# EAGLE design ketamine (EAGLE 6.5.0)
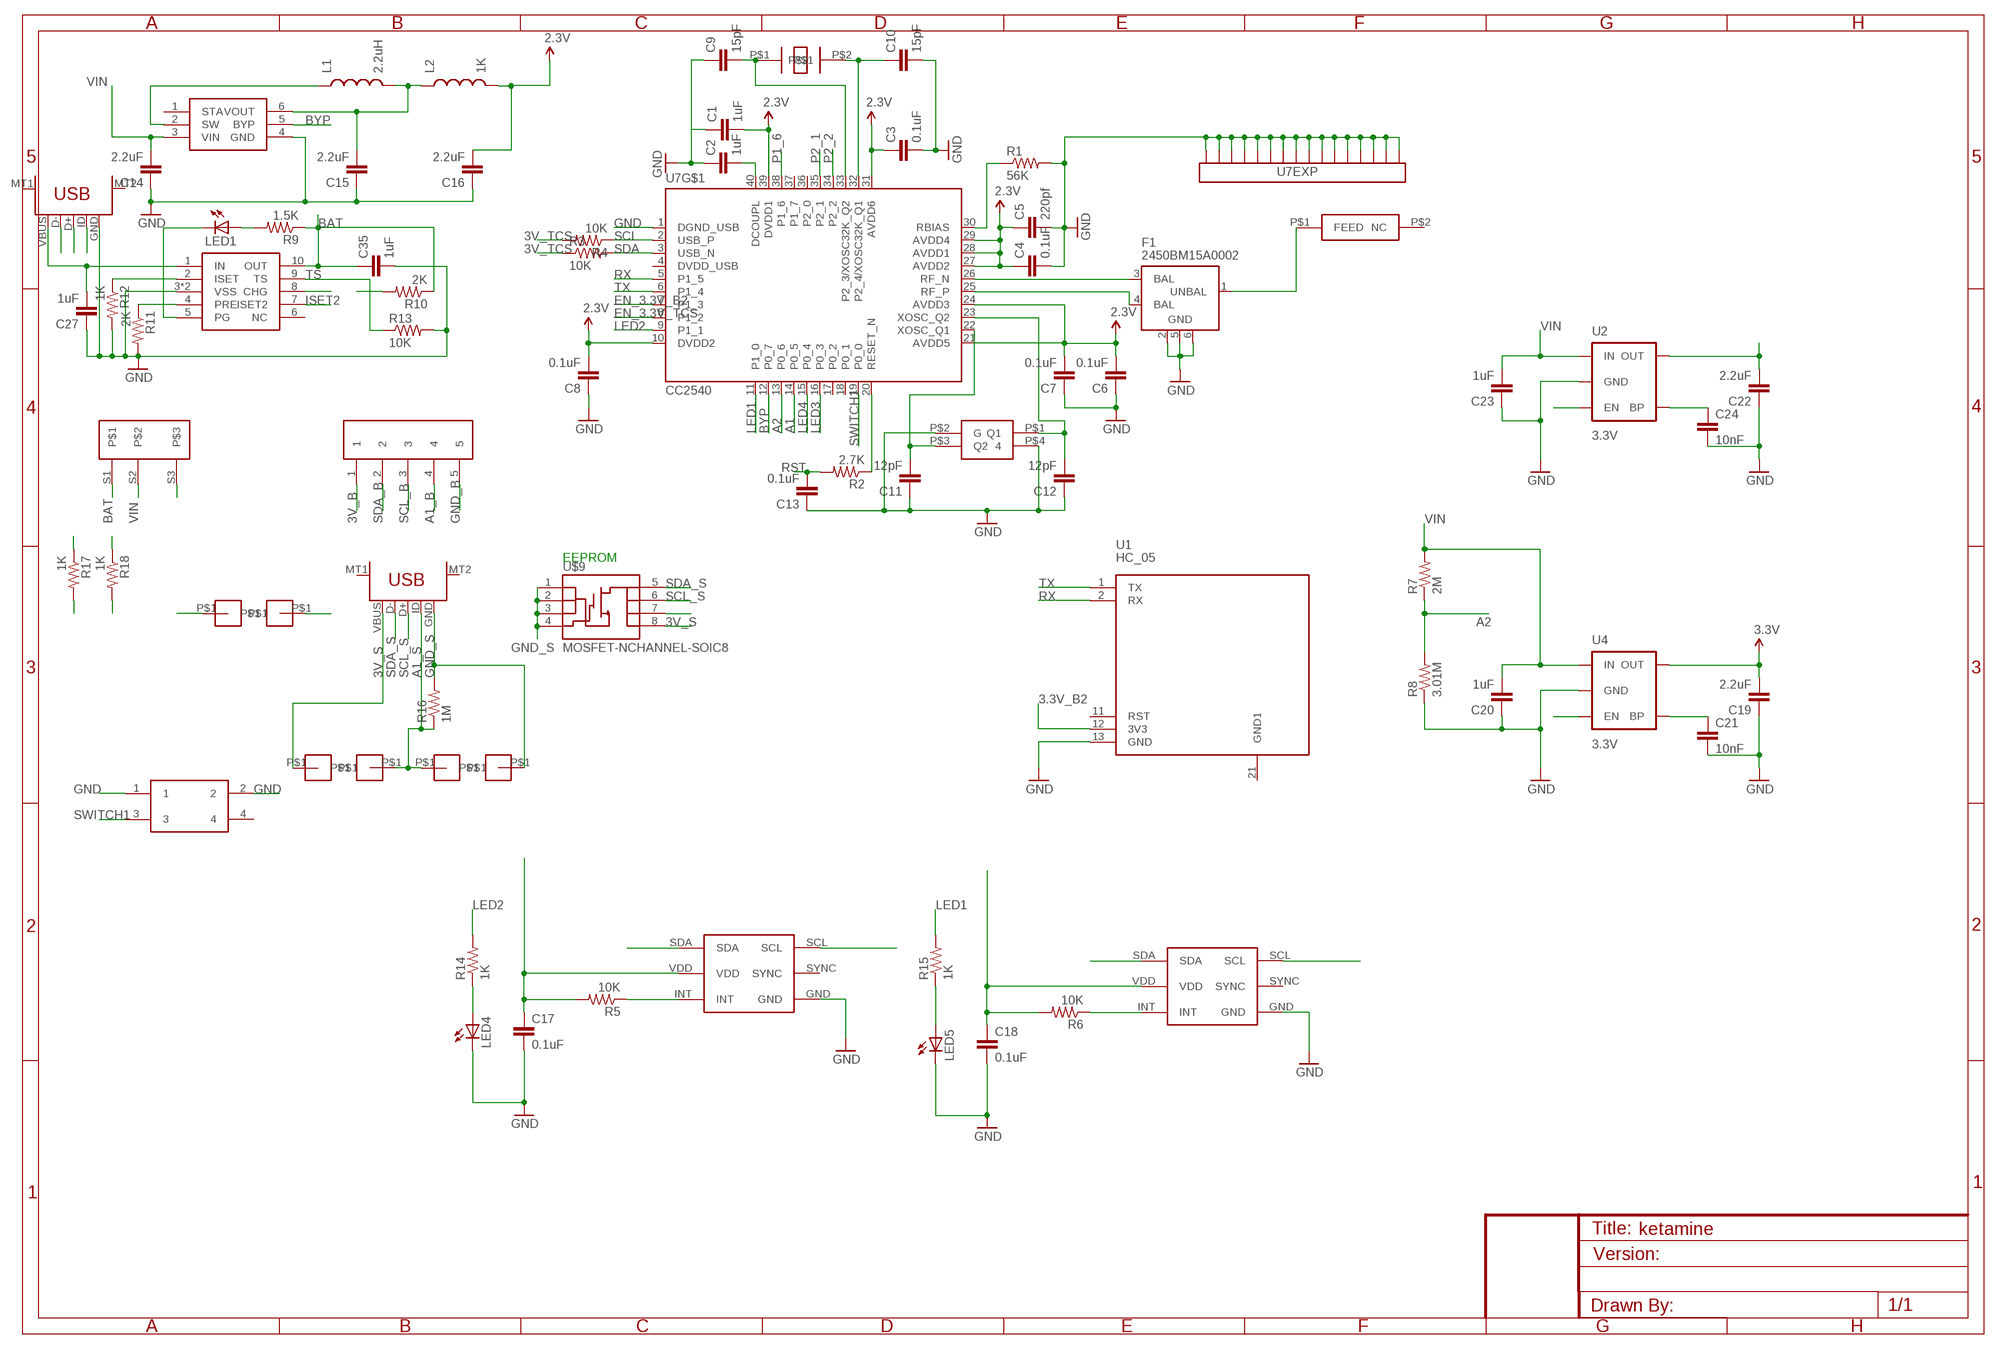
[diagram p0: schematic, sheet 1]

## Parts
C1  1uF  CAP0402-CAP  [0402-CAP]
C2  1uF  CAP0402-CAP  [0402-CAP]
C3  0.1uF  CAP0402-CAP  [0402-CAP]
C4  0.1uF  CAP0402-CAP  [0402-CAP]
C5  220pf  CAP0402-CAP  [0402-CAP]
C6  0.1uF  CAP0402-CAP  [0402-CAP]
C7  0.1uF  CAP0402-CAP  [0402-CAP]
C8  0.1uF  CAP0402-CAP  [0402-CAP]
C9  15pF  CAP0402-CAP  [0402-CAP]
C10  15pF  CAP0402-CAP  [0402-CAP]
C11  12pF  CAP0402-CAP  [0402-CAP]
C12  12pF  CAP0402-CAP  [0402-CAP]
C13  0.1uF  CAP0402-CAP  [0402-CAP]
C14  2.2uF  CAP0402-CAP  [0402-CAP]
C15  2.2uF  CAP0402-CAP  [0402-CAP]
C16  2.2uF  CAP0402-CAP  [0402-CAP]
C17  0.1uF  CAP0402-CAP  [0402-CAP]
C18  0.1uF  CAP0402-CAP  [0402-CAP]
C19  2.2uF  CAP0402-CAP  [0402-CAP]
C20  1uF  CAP0402-CAP  [0402-CAP]
C21  10nF  CAP0402-CAP  [0402-CAP]
C22  2.2uF  CAP0402-CAP  [0402-CAP]
C23  1uF  CAP0402-CAP  [0402-CAP]
C24  10nF  CAP0402-CAP  [0402-CAP]
C27  1uF  CAP0402-CAP  [0402-CAP]
C35  1uF  CAP0402-CAP  [0402-CAP]
F1  2450BM15A0002  [2450BM15A0002]
L1  2.2uH  INDUCTOR0805  [0805]
L2  1K  INDUCTOR0402  [C0402]
LED1  LED0603  [LED-0603]
LED4  LED0603  [LED-0603]
LED5  LED0603  [LED-0603]
R1  56K  RESISTOR0402-RES  [0402-RES]
R2  2.7K  RESISTOR0402-RES  [0402-RES]
R3  10K  RESISTOR0402-RES  [0402-RES]
R4  10K  RESISTOR0402-RES  [0402-RES]
R5  10K  RESISTOR0402-RES  [0402-RES]
R6  10K  RESISTOR0402-RES  [0402-RES]
R7  2M  RESISTOR0402-RES  [0402-RES]
R8  3.01M  RESISTOR0402-RES  [0402-RES]
R9  1.5K  RESISTOR0402-RES  [0402-RES]
R10  2K  RESISTOR0402-RES  [0402-RES]
R11  2K  RESISTOR0402-RES  [0402-RES]
R12  1K  RESISTOR0402-RES  [0402-RES]
R13  10K  RESISTOR0402-RES  [0402-RES]
R14  1K  RESISTOR0402-RES  [0402-RES]
R15  1K  RESISTOR0402-RES  [0402-RES]
R16  1M  RESISTOR0402-RES  [0402-RES]
R17  1K  RESISTOR0402-RES  [0402-RES]
R18  1K  RESISTOR0402-RES  [0402-RES]
S1  SK12C0405  [SK12C0405]
S2  SWITCH_SMD_6X6  [6X6MM]
U1  HC_05  [BLUETOOTH_SMD]
U2  3.3V  V_REG_LDOSMD  [SOT23-5]
U4  3.3V  V_REG_LDOSMD  [SOT23-5]
U5  TCS3414CS  [CHIPSCALE6]
U6  TCS3414CS  [CHIPSCALE6]
U7  CC2540  [QFN40-6X6]
U$1  2450AT42A100  [2450AT42A100]
U$2  FA128  [FA128]
U$3  ST3215SB  [ST3215SB]
U$4  TPS62730  [TPS62730]
U$8  MICRO_USB_PLUG  [MICRO_USB_PLUG]
U$9  MOSFET-NCHANNEL-SOIC8  [SO08]
U$10  5X3PAD  [5X3PAD]
U$11  5X3PAD  [5X3PAD]
U$12  5X3PAD  [5X3PAD]
U$13  5X3PAD  [5X3PAD]
U$14  5X3PAD  [5X3PAD]
U$15  5X3PAD  [5X3PAD]
U$23  BQ24040  [WSON-10]
X1  USB_MICROB_RECEPT  [USB-MICROB]
X2  USB_MICROB_RECEPT  [USB-MICROB]

## Nets
2.3V: C1.2 C3.1 C4.1 C5.1 C6.2 C7.2 C8.2 C16.2 L2.2 U7.10(DVDD2) U7.21(AVDD5) U7.24(AVDD3) U7.27(AVDD2) U7.28(AVDD1) U7.29(AVDD4) U7.31(AVDD6) U7.39(DVDD1)
3.3V_B2: C19.2 U1.12(3V3) U4.5(OUT) ; supply symbol labelled 3.3V
3V_B: U$8.1
3V_S: U$9.8(D) U$14.P$1 X2.VBUS
3V_TCS: C17.1 C18.1 C22.2 R3.1 R4.2 R5.2 R6.2 U2.5(OUT) U5.VDD U6.VDD
A1: U7.14(P0_5)
A1_B: U$8.4
A1_S: R16.1 U$10.P$1 U$15.P$1 X2.ID
A2: R7.1 R8.2 U7.13(P0_6)
BAT: C35.1 R9.1 R10.1 S1.S1 U$23.10(OUT)
BYP: U7.12(P0_7) U$4.5(BYP)
EN_3.3V_B2: U4.3(EN) U7.7(P1_3)
EN_3.3V_TCS: U2.3(EN) U7.8(P1_2)
GND: C1.1 C2.1 C3.2 C4.2 C5.2 C6.1 C7.1 C8.1 C9.1 C10.2 C11.1 C12.1 C13.1 C14.1 C15.1 C16.1 C17.2 C18.2 C19.1 C20.1 C21.2 C22.1 C23.1 C24.2 C27.1 C35.2 F1.2(GND) F1.5(GND) F1.6(GND) LED4.C LED5.C R1.2 R8.1 R11.2 R12.2 R13.2 S2.1 S2.2 U1.13(GND) U2.2(GND) U4.2(GND) U5.GND U6.GND U7.1(DGND_USB) U7.EXP@1(EXP:EXP16) U7.EXP@2(EXP:EXP16) U7.EXP@3(EXP:EXP16) U7.EXP@4(EXP:EXP16) U7.EXP@5(EXP:EXP16) U7.EXP@6(EXP:EXP16) U7.EXP@7(EXP:EXP16) U7.EXP@8(EXP:EXP16) U7.EXP@9(EXP:EXP16) U7.EXP@10(EXP:EXP16) U7.EXP@11(EXP:EXP16) U7.EXP@12(EXP:EXP16) U7.EXP@13(EXP:EXP16) U7.EXP@14(EXP:EXP16) U7.EXP@15(EXP:EXP16) U7.EXP@16(EXP:EXP16) U$2.P$2(G) U$2.P$4 U$4.4(GND) U$23.3(VSS) U$23.PAD(VSS) X1.GND
GND_B: U$8.5
GND_S: R16.2 U$9.1(S) U$9.2(S) U$9.3(S) U$9.4(G) U$9.7(D) U$11.P$1 X2.GND
INT: R5.1 U5.INT
INT1: R6.1 U6.INT
ISET2: U$23.7(ISET2)
LED1: R15.2 U7.11(P1_0)
LED2: R14.2 U7.9(P1_1)
LED3: R17.2 U7.16(P0_3)
LED4: R18.2 U7.15(P0_4)
N$1: R1.1 U7.30(RBIAS)
N$2: C21.1 U4.4(BP)
N$3: F1.3(BAL) U7.26(RF_N)
N$4: F1.4(BAL) U7.25(RF_P)
N$5: C2.2 U7.40(DCOUPL)
N$6: C9.2 U7.33(P2_3/XOSC32K_Q2) U$3.P$1
N$7: C24.1 U2.4(BP)
N$8: C11.2 U7.22(XOSC_Q1) U$2.P$3(Q2)
N$9: C12.2 U7.23(XOSC_Q2) U$2.P$1(Q1)
N$10: C10.1 U7.32(P2_4/XOSC32K_Q1) U$3.P$2
N$11: L1.1 U$4.2(SW)
N$12: C15.2 L1.2 L2.1 U$4.6(VOUT)
N$13: S1.S3
N$15: U$13.P$1
N$16: U$12.P$1
N$18: R18.1
N$19: F1.1(UNBAL) U$1.P$1(FEED)
N$20: R17.1
N$24: R2.1 U7.20(RESET_N)
N$26: LED1.C U$23.5(PG)
N$27: LED1.A R9.2
N$28: LED4.A R14.1
N$29: LED5.A R15.1
N$41: R11.1 U$23.4(PRE)
N$49: R12.1 U$23.2(ISET)
N$51: U$23.8(CHG)
N$52: R10.2
P1_6: U7.38(P1_6)
P2_1: U7.35(P2_1) X1.D+
P2_2: U7.34(P2_2) X1.ID
RST: C13.2 R2.2 X1.D-
RX: U1.2(RX) U7.5(P1_5)
SCL: R4.1 U5.SCL U6.SCL U7.2(USB_P)
SCL_B: U$8.3
SCL_S: U$9.6(D) X2.D+
SDA: R3.2 U5.SDA U6.SDA U7.3(USB_N)
SDA_B: U$8.2
SDA_S: U$9.5(D) X2.D-
SWITCH1: S2.3 U7.19(P0_0)
TS: R13.1 U$23.9(TS)
TX: U1.1(TX) U7.6(P1_4)
VBUS: C27.2 U$23.1(IN) X1.VBUS
VIN: C14.2 C20.2 C23.2 R7.2 S1.S2 U2.1(IN) U4.1(IN) U$4.3(VIN)
Unconnected: S2.4 U1.11(RST) U1.21(GND1) U5.SYNC U6.SYNC U7.17(P0_2) U7.18(P0_1) U7.36(P2_0) U7.37(P1_7) U$1.P$2(NC) U$4.1(STA) U$23.6(NC) X1.MT1(MTN2) X1.MT2(MTN4) X2.MT1(MTN2) X2.MT2(MTN4)

## Notes on the sheet
- EEPROM

## Power pins joined to a net without a drawn wire
DVDD_USB: U7.4(DVDD_USB)

## Library data of the parts
C1-C18 C27 C35 = SparkFun:CAP: Capacitor Standard 0603 ceramic capacitor, and 0.1" leaded capacitor.
C19-C24 = SparkFun-Capacitors:CAP: Capacitor Standard 0603 ceramic capacitor, and 0.1" leaded capacitor.
F1 = johanson-technology:2450BM15A0002: 2.45 GHz Impedance Matched Balun-Filter For TI CC253X/CC2540 Chipset family Data sheet <http://www.johansontechnology.com/images/stories/ip/baluns/balun_filter_combo_matched_2450bm15a0002_v8.pdf>
L1 L2 = SparkFun:INDUCTOR: Inductors Basic Inductor/Choke - 0603 and 1206. Footprints are not proven and vary greatly between part numbers.
LED1 LED4 LED5 = SparkFun:LED: LEDs Standard schematic elements and footprints for 5mm, 3mm, 1206, and 0603 sized LEDs. 5mm - Spark Fun Electronics SKU : COM-00529 (and others)
R1-R6 R9-R18 = SparkFun:RESISTOR: Resistor Basic schematic elements and footprints for 0603, 1206, and PTH resistors.
R7 R8 = SparkFun-Resistors:RESISTOR: Resistor Basic schematic elements and footprints for 0603, 1206, and PTH resistors.
S1 = Switch_SK12C0405:SK12C0405
S2 = SWITCH_SMD:SWITCH_SMD_6X6
U1 = Bluetooth HC-05:HC_05: HC-05 Bluetooth Module
U2 U4 = SparkFun:V_REG_LDO: Voltage Regulator LDO Standard 150mA LDO voltage regulator in SOT-23 layout. Micrel part MIC5205. BP (by-pass) pin is used to lower output noise with 470pF cap.
U5 U6 = TCS3414CS:TCS3414CS
U7 = texas:CC2540: 2.4-GHz Bluetooth® low energy System-on-Chip Auto generated by make-symbol-device-package-bsdl.ulp Rev. 39 Source: cc2540.txt
U$1 = 2450AT42A100:2450AT42A100
U$2 = FA128:FA128
U$3 = ST3215sb:ST3215SB
U$4 = TPS62730:TPS62730
U$8 = Micro_USB_plug_pcb:MICRO_USB_PLUG
U$9 = SparkFun:MOSFET-NCHANNEL-SOIC8: N-Channel MOSFET IRF9410 and NDS8434 are common, SOIC-8 parts.
U$10-U$15 = 5x3Pad:5X3PAD
U$23 = PP_DigitalIC:BQ24040
X1 X2 = SparkFun:USB_MICROB_RECEPT

## Board
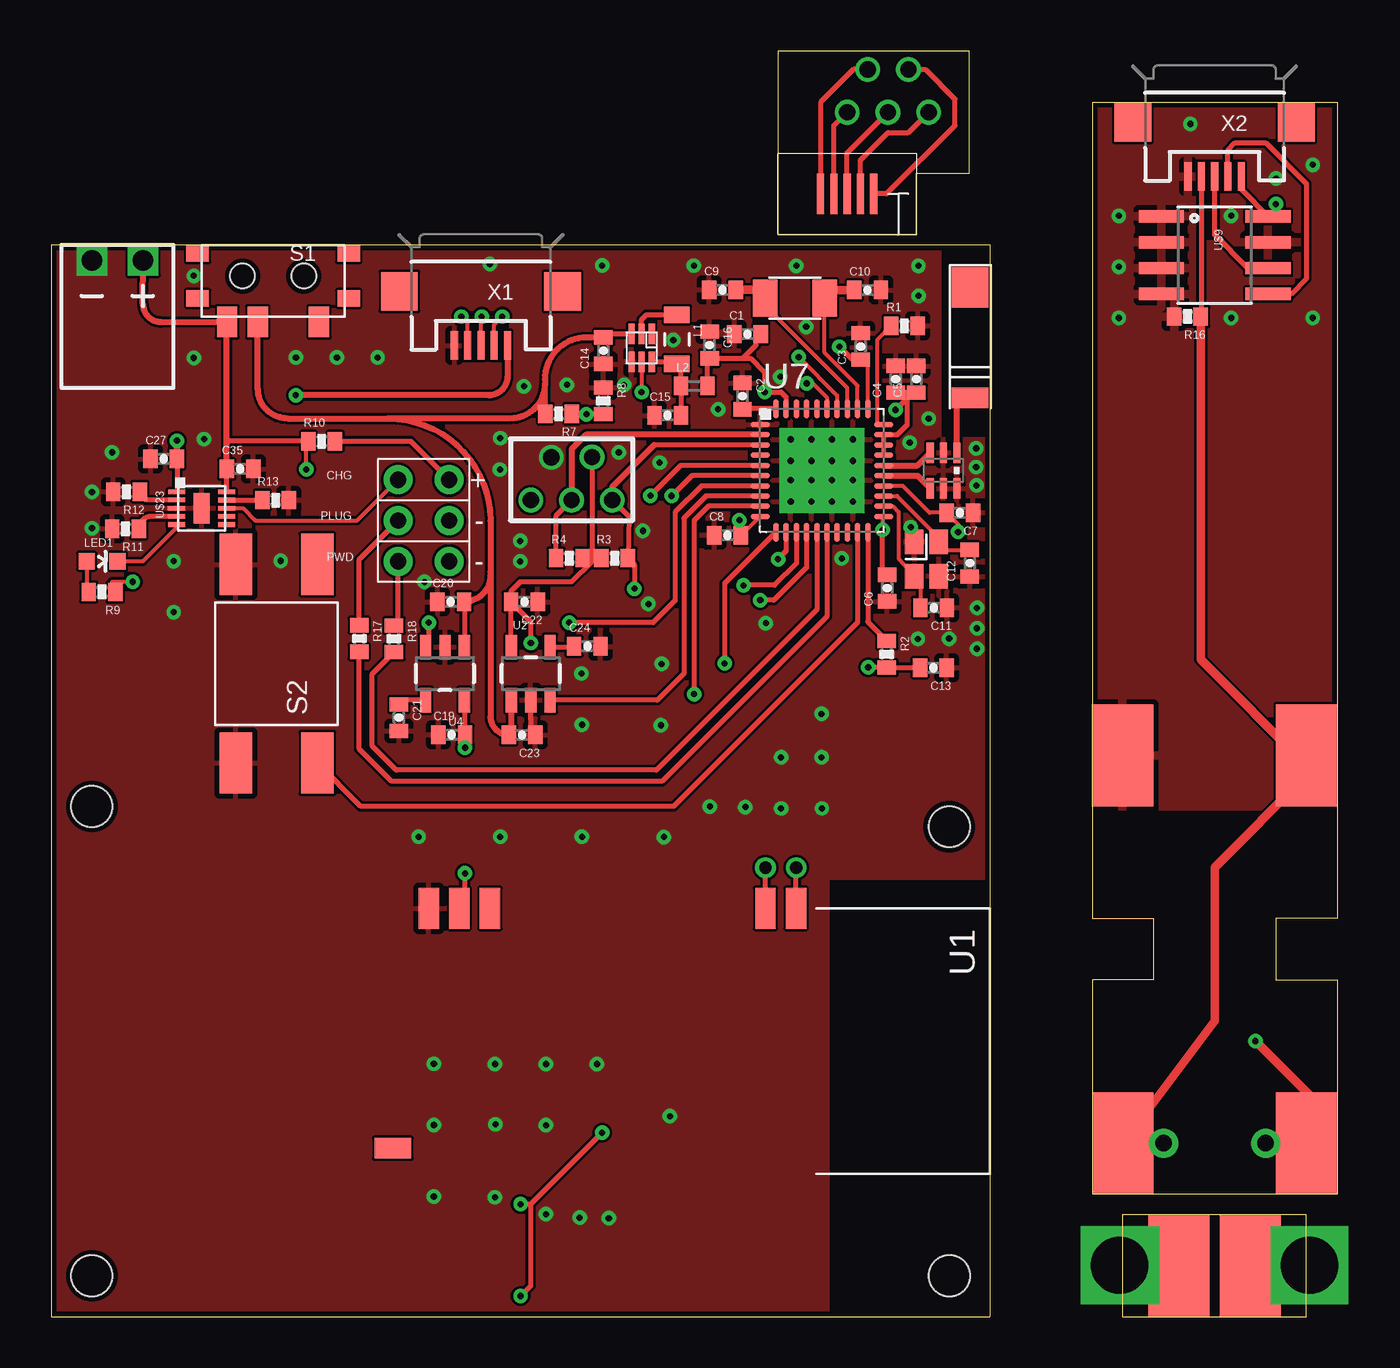
[diagram p1: board, top side]
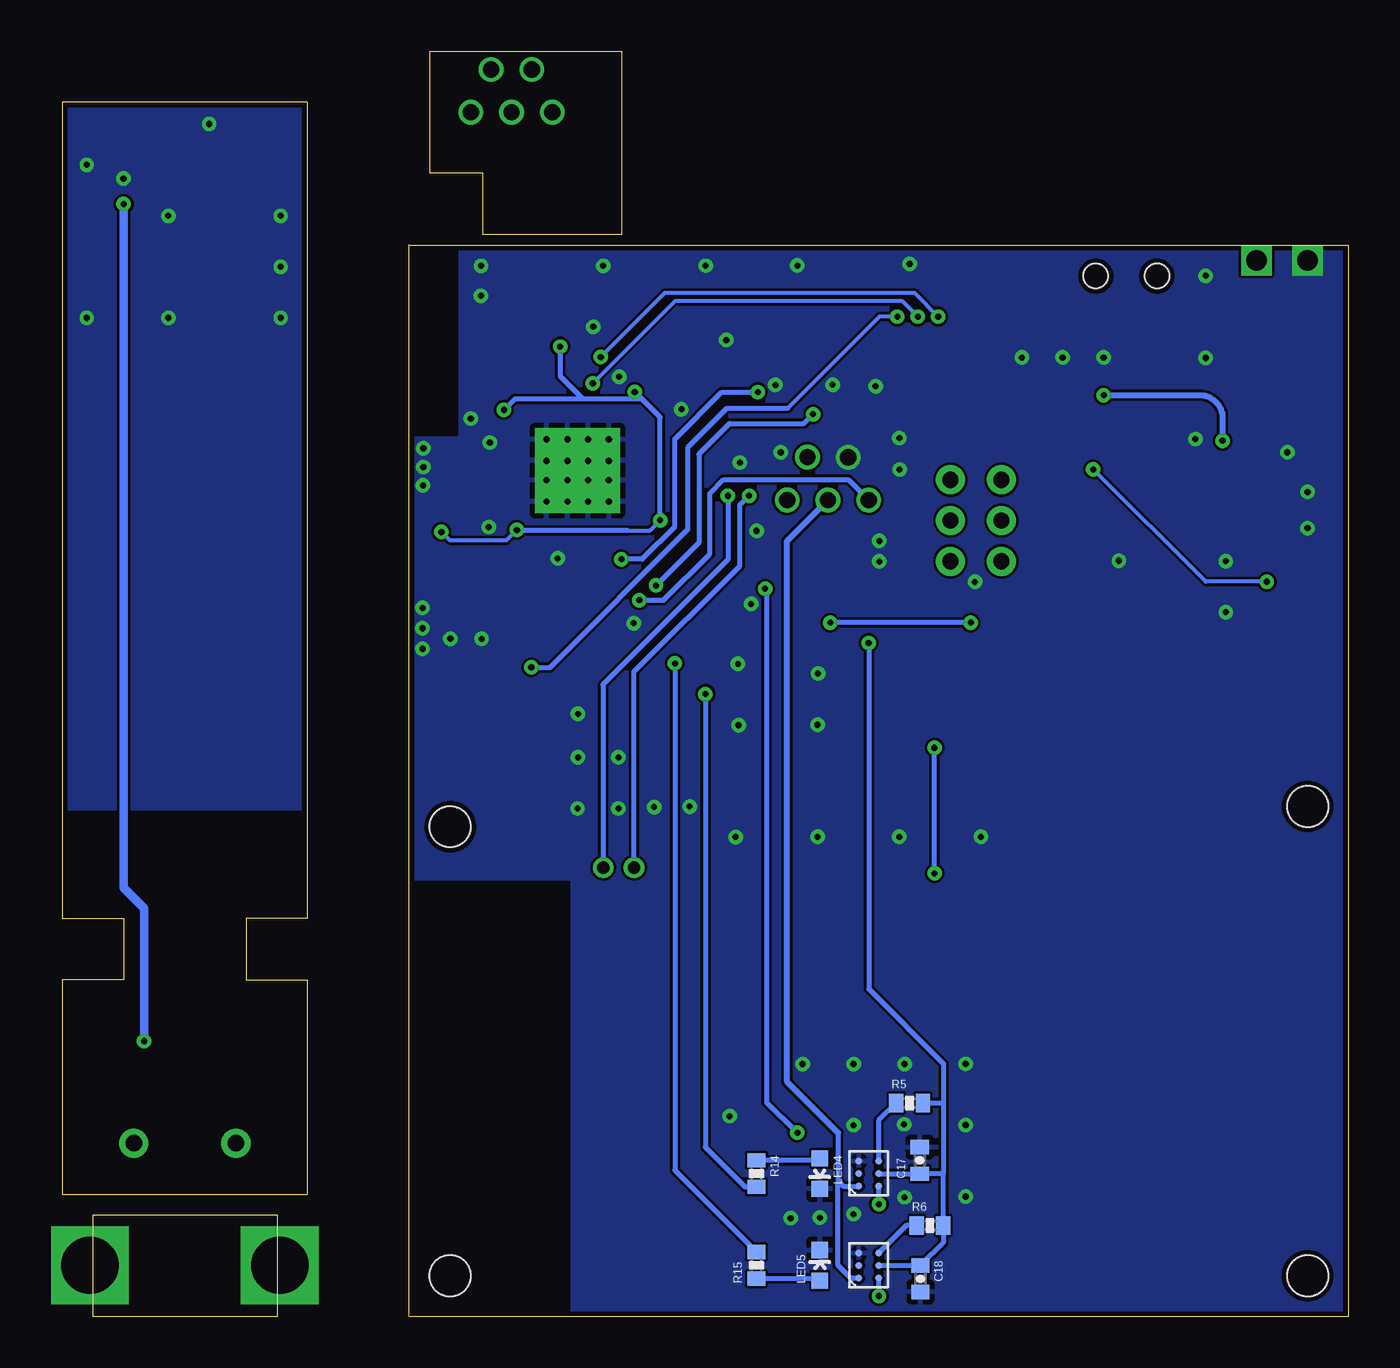
[diagram p2: board, bottom side, seen from below]

Size 63 x 62 mm. Coordinates in mm from the lower left corner, seen from the top.
Outline: 46.02,0.02 46.02,52.52
Outline: 46,52.5 0,52.5 0,0 46,0
Outline: 51,59.5 63,59.5 63,19.5 60,19.5 60,16.5 63,16.5 63,6 51,6 51,16.5 54,16.5 54,19.5 51,19.5 51,59.5
Outline: 35.6,53 42.4,53 42.4,56.01 45,56.01 45,62 35.6,62 35.6,53
Outline: 61.5,5 52.47,5 52.47,0 61.5,0 61.5,5
Copper layers (1*16): Top 0.035mm / dielectric 1.5mm / Bottom 0.035mm
Design rules "default *": minimum track width 4mil, minimum drill 4mil, track to track 5mil, track to pad 5mil, pad to pad 5mil, via to via 5mil, smd to smd 5mil, copper to edge 10mil, drill to drill 8mil, minimum pad ring 10mil, minimum via ring 8mil, stop-mask expansion 4mil, vias tented up to drill 0mil, thermal gap 10mil
Holes 2 mm at 2,25 44,24 2,2 44,2

### Footprints (pad centres in the part's own frame; a part is rotated, then mirrored left to right if it is on the bottom)
0402-CAP = smd 0.7 x 0.9: 1 -0.65,0; 2 0.65,0
2450BM15A0002 = smd 0.35 x 1: 1 -0.65,-0.875; 2 0,-0.875; 3 0.65,-0.875; 4 0.65,0.875; 5 0,0.875; 6 -0.65,0.875
0805 = smd 0.8 x 1.25: 1 -1.2,0; 2 1.2,0
C0402 = smd 0.7 x 0.9: 1 -0.65,0; 2 0.65,0
LED-0603 = smd 0.8 x 0.8: A 0,-0.75; C 0,0.75
0402-RES = smd 0.7 x 0.9: 1 -0.65,0; 2 0.65,0
SK12C0405 = smd 1.1 x 0.8: P$1 -3.7,-1.1; P$2 -3.7,1.1; P$3 3.7,-1.1; P$4 3.7,1.1 | smd 1 x 1.5: S1 2.25,2.25; S2 0.75,2.25; S3 -2.25,2.25 | hole 1.2: -1.5,0; 1.5,0
6X6MM = smd 3 x 1.6: 1 -4.865,2; 2 4.865,2; 3 -4.865,-2; 4 4.865,-2
BLUETOOTH_SMD = smd 2 x 1: 1 0,0; 2 0,-1.5; 11 0,-15; 12 0,-16.5; 13 0,-18 | smd 1 x 1.8: 21 11.75,-19.75
SOT23-5 = smd 0.55 x 1.2: 1 -0.95,-1.3; 2 0,-1.3; 3 0.95,-1.3; 4 0.95,1.3; 5 -0.95,1.3
CHIPSCALE6 = smd 0.35 x 0.35: GND 0.61,0.485; INT 0.61,-0.485; SCL -0.61,0.485; SDA -0.61,-0.485; SYNC 0,0.485; VDD 0,-0.485
QFN40-6X6 = smd 0.95 x 0.28: 1 -3.025,2.25; 2 -3.025,1.75; 3 -3.025,1.25; 4 -3.025,0.75; 5 -3.025,0.25; 6 -3.025,-0.25; 7 -3.025,-0.75; 8 -3.025,-1.25; 9 -3.025,-1.75; 10 -3.025,-2.25; 21 3.025,-2.25; 22 3.025,-1.75; 23 3.025,-1.25; 24 3.025,-0.75; 25 3.025,-0.25; 26 3.025,0.25; 27 3.025,0.75; 28 3.025,1.25; 29 3.025,1.75; 30 3.025,2.25 | smd 0.28 x 0.95: 11 -2.25,-3.025; 12 -1.75,-3.025; 13 -1.25,-3.025; 14 -0.75,-3.025; 15 -0.25,-3.025; 16 0.25,-3.025; 17 0.75,-3.025; 18 1.25,-3.025; 19 1.75,-3.025; 20 2.25,-3.025; 31 2.25,3.025; 32 1.75,3.025; 33 1.25,3.025; 34 0.75,3.025; 35 0.25,3.025; 36 -0.25,3.025; 37 -0.75,3.025; 38 -1.25,3.025; 39 -1.75,3.025; 40 -2.25,3.025 | drill 0.3 pad 1.1 square: EXP@1 -1.525,1.525; EXP@2 -0.5,1.525; EXP@3 0.5,1.525; EXP@4 1.525,1.525; EXP@5 -1.525,0.475; EXP@6 -0.5,0.475; EXP@7 0.5,0.475; EXP@8 1.525,0.475; EXP@9 -1.525,-0.475; EXP@10 -0.5,-0.475; EXP@11 0.5,-0.475; EXP@12 1.525,-0.475; EXP@13 -1.525,-1.525; EXP@14 -0.5,-1.525; EXP@15 0.5,-1.525; EXP@16 1.525,-1.525
2450AT42A100 = smd 1 x 1.8: P$1 -2.5,0 | smd 2 x 1.8: P$2 2.9,0
FA128 = smd 1.2 x 0.9: P$1 -0.85,0.6; P$2 0.85,0.6; P$3 0.85,-0.6; P$4 -0.85,-0.6
ST3215SB = smd 1.2 x 1.8: P$1 -1.2,0; P$2 1.7,0
TPS62730 = smd 0.3 x 1: 1 -0.5,-0.68; 2 0,-0.68; 3 0.5,-0.68; 4 0.5,0.68; 5 0,0.68; 6 -0.5,0.68
MICRO_USB_PLUG = smd 0.35 x 2: 1 -1.3,1.5; 2 -0.65,1.5; 3 0,1.5; 4 0.65,1.5; 5 1.3,1.5
SO08 = smd 0.61 x 2.21: 1 -1.905,-2.616; 2 -0.635,-2.616; 3 0.635,-2.616; 4 1.905,-2.616; 5 1.905,2.616; 6 0.635,2.616; 7 -0.635,2.616; 8 -1.905,2.616
5X3PAD = smd 3 x 5: P$1 0,0
WSON-10 = smd 0.23 x 0.85: 1 -0.8,-1.225; 2 -0.41,-1.225; 3 0,-1.23; 4 0.4,-1.225; 5 0.8,-1.225; 6 0.8,1.225; 7 0.4,1.225; 8 0,1.225; 9 -0.4,1.225; 10 -0.8,1.225 | smd 1.5 x 0.8: PAD 0,0
USB-MICROB = smd 0.35 x 1.4: D+ 0,2.65; D- -0.65,2.65; GND 1.3,2.65; ID 0.65,2.65; VBUS -1.3,2.65 | smd 1.8 x 1.9: MT1 -4,0; MT2 4,0

### Placement (x,y rotation side)
C1  34.12,48.13 0 top
C2  33.87,45.09 270 top
C3  39.66,47.53 90 top
C4  41.38,45.92 90 top
C5  42.39,45.92 90 top
C6  40.96,35.69 90 top
C7  44.52,39.38 180 top
C8  33.14,38.28 0 top
C9  32.89,50.3 0 top
C10  40,50.29 0 top
C11  43.24,34.73 180 top
C12  45.01,36.91 90 top
C13  43.22,31.79 180 top
C14  27.06,47.32 90 top
C15  30.21,44.15 0 top
C16  32.26,47.6 270 top
C17  21,7.65 90 bottom
C18  20.97,1.86 270 bottom
C19  19.63,28.51 0 top
C20  19.58,35.02 0 top
C21  17.04,29.34 270 top
C22  23.19,35.02 180 top
C23  23.07,28.5 180 top
C24  26.27,32.84 0 top
C27  5.52,42.02 0 top
C35  9.26,41.53 0 top
F1  43.72,41.45 180 top
L1  30.66,47.88 270 top
L2  31.51,45.59 0 top
LED1  2.5,37 270 top
LED4  25.9,7.01 180 bottom
LED5  25.9,2.51 0 bottom
R1  41.81,48.54 0 top
R2  40.94,32.45 270 top
R3  27.61,37.16 0 top
R4  25.39,37.16 0 top
R5  21.5,10.47 0 bottom
R6  20.5,4.47 0 bottom
R7  24.86,44.23 180 top
R8  27.06,44.86 270 top
R9  2.5,35.5 180 top
R10  13.26,42.88 0 top
R11  3.65,38.6 180 top
R12  3.7,40.41 180 top
R13  11,40 0 top
R14  29,7.01 270 bottom
R15  29,2.52 90 bottom
R16  55.67,48.99 180 top
R17  15.1,33.22 270 top
R18  16.8,33.21 270 top
S1  10.88,50.98 180 top
S2  11.05,31.99 90 top
U1  36.5,20 270 top
U2  23.5,31.5 0 top
U4  19.3,31.5 180 top
U5  23.5,7 90 bottom
U6  23.5,2.5 90 bottom
U7  37.76,41.45 0 top
U$1  45.03,47.52 90 top
U$2  42.89,37.12 270 top
U$3  36.19,49.9 0 top
U$4  28.93,47.46 180 top
U$8  39,56.5 180 top
U$9  57,52 270 top
U$10  61.5,27.5 0 top
U$11  52.49,27.5 0 top
U$12  58.75,2.5 0 top
U$13  55.25,2.5 0 top
U$14  61.5,8.5 0 top
U$15  52.5,8.5 0 top
U$23  7.38,39.6 270 top
X1  21.06,50.23 180 top
X2  57,58.5 180 top

### Tracks (layer width: path | path; a pad name or v marks a point on that pad's centre or on a via)
2.3V  (via drill 0.3)
  Top 0.2: C4.1 41.89,45.27 41.92,45.27 C5.1 | U7.24 41.72,40.7 43.04,39.38 C7.2 44.44,38.81 v44.44,38.44 | U7.31 40.01,46.88 C3.1 | U7.21 40.74,39.16 v40.74,38.54 | U7.10 arc90 U7.10 33.83,38.29 | C8.2 33.83,38.29 | 33.83,38.29 33.83,38.91 v33.72,39.02
  Top 0.254: U7.27 U7.28 U7.29 41.46,43.2 41.95,43.69 41.95,45.21 41.89,45.27 | L2.2 32.16,46.85 C16.2 33.89,46.95 | C3.1 39.26,46.88 v38.62,47.52 | v40.74,38.54 40.74,36.2 C6.2 | 33.89,46.95 34.54,47.6 34.54,47.9 C1.2 | U7.39 36.01,45.05 35.76,45.3 v34.96,45.3 34.96,46.25 34.26,46.95 33.89,46.95 | 41.92,45.27 41.92,44.97 v41.37,44.42
  Bottom 0.102: v40.74,38.54 40.86,38.45 39.59,38.45 39.59,38.52
  Bottom 0.2: v40.74,38.54 41.26,38.02 44.02,38.02 v44.44,38.44 | 35.32,38.52 34.22,38.52 v33.72,39.02
  Bottom 0.254: 35.32,38.52 39.59,38.52 40.72,38.52 | v33.72,39.02 33.72,44.06 34.62,44.95 | 34.62,44.95 v34.96,45.3 | 34.62,44.95 37.5,44.95 | 37.5,44.95 40.84,44.95 v41.37,44.42 | v38.62,47.52 38.62,46.08 37.5,44.95
3.3V_B2  (via drill 0.3)
  Top 0.254: U4.5 20.28,30.17 C19.2 v20.28,27.87 | U1.12 20.28,20.28 v20.28,21.72
  Bottom 0.254: v20.28,21.72 v20.28,27.87
3V_B  (via drill 0.8)
  Top 0.254: 40.33,55.87 40.3,55.84 U$8.1 40.93,55 44.28,58.35 44.28,59.65 42.85,61.08 42.02,61.08 v42,61.1
3V_S  (via drill 0.3, 0.8 pad 1.42)
  Top 0.254: X2.VBUS 58.3,55.22 U$9.8
  Top 0.406: v59,13.5 62.5,10 U$14.P$1 v59.5,8.5 | v60,54.5 60,54 59.71,54 U$9.8
  Bottom 0.406: v60,54.5 60,21 59,20 v59,13.5
3V_TCS  (via drill 0.3, 0.8)
  Top 0.254: R3.1 R4.2 26.34,37.16 26.5,37 | v26.5,42.11 26.5,37 | 22.5,35.06 C22.2 | C22.2 22.54,35.54 23,36 25.5,36 26.5,37 | C22.2 23.5,34.06 v23.5,33 | U2.5 C22.2
  Bottom 0.254: U5.VDD C17.1 19.85,7.01 | U6.VDD 23,2.51 C18.1 19.85,3.63 R6.2 19.85,7.01 | 19.86,7 19.85,7.01 | 19.85,10.51 19.85,7.01 | R5.2 19.89,10.47 arc-90 19.85,10.51 | 19.85,10.51 19.84,10.52 19.84,12.39 23.5,16.05 v23.5,33
A1  (via drill 0.3, 0.8)
  Top 0.254: v34.74,35.1 35.41,35.1 37.01,36.7 U7.14
  Bottom 0.254: v23.5,40 24.5,41 30.61,41 31.28,40.33 31.28,37.37 33.55,35.1 v34.74,35.1
A1_B  (via drill 0.8)
  Top 0.254: U$8.4 38.35,58.35 v39,59
A1_S  (via drill 0.8 pad 1.42)
  Top 0.254: X2.ID 56.35,49.02 R16.1
  Top 0.406: 61.5,27 61.5,26.5 57,22 57,14.5 U$15.P$1 v54.5,8.5 | 61.5,27 U$10.P$1 | R16.1 56.32,32.18 61.5,27
A2  (via drill 0.3)
  Top 0.254: R8.2 v26.23,44.21 25.53,44.21 R7.1 | U7.13 36.51,36.89 35.45,35.83 v33.93,35.83 v33.92,35.82
  Top 0.3: 25.51,44.33 R7.1
  Bottom 0.254: v33.92,35.82 31.82,37.92 31.82,42.25 30.31,43.76 26.68,43.76 v26.23,44.21
BAT  (via drill 0.3, 1)
  Top 0.102: 8.7,48.7 S1.S1
  Top 0.2: v12.5,41.5 12.5,42.5 R10.1 | v4,36 3,36 3,35.5 R9.1
  Top 0.254: U$23.10 C35.1 | R10.1 8.73,42.88 8.61,43
  Top 0.3: C35.1 8.61,43 8.61,48.71 S1.S1 8.12,48.74 5.38,48.73 arc-90 4.5,49.61 v4.51,51.75
  Bottom 0.2: v4,36 7,36 v12.5,41.5
BYP  (via drill 0.3)
  Top 0.2: U$4.5 v28.93,45.29
  Top 0.254: U7.12 36.01,37.5 v35.62,37.11
  Bottom 0.254: v28.93,45.29 30.71,45.29 33,43 33,38.71 34.6,37.11 v35.62,37.11
EN_3.3V_B2  (via drill 0.3)
  Top 0.254: U7.7 31.86,40.7 30.57,39.41 30.57,35.07 29.5,34 v25.38,34 | v18.5,34 18.5,33 U4.3
  Bottom 0.254: v18.5,34 v25.38,34
EN_3.3V_TCS
  Top 0.254: U7.8 32.08,40.2 31,39.12 31,31.5 29.7,30.2 U2.3 | U2.3
GND  (via drill 0.3, 0.8, 1)
  Top 0.102: 43.95,34.66 44.02,34.62 C11.1 | U$2.P$4 42.2,38 42.2,38.6 v42.12,38.68
  Top 0.254: U2.2 23.5,28.72 C23.1
  other vias: 6.01,37.01 32.68,44.45 45.34,40.72 42.5,50.01 45.32,41.62 30.48,47.84 42.06,42.82 45.36,33.72 36.51,51.48 45.36,34.72 45.32,42.54 2.01,51.75 24.5,42.1 25.27,45.65 23.17,45.58 16,46.99 14,46.99 30.32,9.82 27.32,4.82 21.75,5.84 11.25,37.03 7.5,42.99 6.01,34.51 22,43.04 22.98,38 37.75,27.4 29,38.49 22,41.49 42.99,43.99 43.99,33.22 42.47,33.2 18.3,35.99 29.91,31.98 29.27,34.91 29.88,28.98 26,29 25.98,31.5 31.5,51.48 21.5,51.58 2,38.62 2,40.4 3,42.34 11.99,46.99 37.74,29.53 25.89,4.84 24.25,5.02 18.75,5.88 24.25,9.38 26.75,12.37 24.25,12.37 21.75,12.37 28.07,45.64 37.77,24.89 35.77,27.39 35.77,24.89 38.74,37.14 36.99,48.49 27,51.49 22.98,37 34.02,24.96 32.27,24.98 30.02,23.5 26,23.5 22,23.5 18,23.5 7,50.99 7,46.97 35.02,33.98 45.36,32.72 42.49,51.48 21.77,9.42 18.75,9.38 18.75,12.38 35.73,46.05 29.81,41.84 27.81,42.34
  pour Bottom: -3.5,52.5 43.5,52.5 43.5,43 46,43 46,21.5 38,21.5 38,0 -3.5,0
  pour Top: -1,52.5 43.5,52.5 43.5,43 46,43 46,21.5 38,21.5 38,0 -1,0
GND_B  (via drill 0.8)
  Top 0.254: U$8.5 37.7,59.49 39.31,61.1 v40,61.1
GND_S  (via drill 0.3)
  Top 0.254: U$9.7 59.87,52.63 60,52.5
  other vias: 57.81,53.93 57.81,48.93 61.81,48.93 61.81,56.43 55.81,58.43 52.31,48.93 52.31,51.43 52.31,53.93 60.01,55.76
  pour Top: 51,25 63,25 63,63.5 51,63.5
  pour Bottom: 51,62.5 63,62.5 63,25 51,25
INT
  Bottom 0.254: R5.1 23.02,9.61 U5.INT
INT1
  Bottom 0.254: R6.1 21.66,4.47 U6.INT
LED1  (via drill 0.3)
  Top 0.254: v33,32 33,35.91 U7.11
  Bottom 0.254: v33,32 33,7.17 R15.2
LED2  (via drill 0.3)
  Top 0.254: U7.9 32.2,39.7 31.5,39 v31.5,30.5
  Bottom 0.254: v31.5,30.5 31.5,8.3 29.56,6.36 R14.2
LED3
  Top 0.254: U7.16 38.01,34.3 29.93,26.22 16.69,26.22 15.1,27.81 R17.2
LED4
  Top 0.254: U7.15 37.51,34.63 29.65,26.77 16.91,26.77 15.73,27.95 15.73,31.49 R18.2
N$1
  Top 0.2: U7.30 40.49,43.7 40.49,47.87 R1.1 40.86,48.28
N$2
  Top 0.254: U4.4 17.22,30.2 C21.1
N$3
  Top 0.3: U7.26 42.45,41.7 F1.3
N$4
  Top 0.3: U7.25 42.45,41.2 F1.4
N$5
  Top 0.254: U7.40 34.23,44.48 C2.2
N$6
  Top 0.2: U7.33 39.01,45.49 35,49.5 U$3.P$1 34.98,49.46
  Top 0.406: C9.2 34.59,50.3 U$3.P$1
N$7
  Top 0.254: U2.4 25.58,32.8 C24.1
N$8
  Top 0.2: U7.22 41.24,39.7 41.52,39.42 41.52,37.14 U$2.P$3 42.59,35.97 C11.2
N$9
  Top 0.2: U7.23 41.44,40.2 43.22,38.42 43.22,38.24 U$2.P$1 43.9,37.56 C12.2
N$10
  Top 0.2: 38.28,50.29 U$3.P$2 37.92,49.87 37.92,49.12 37.89,49.09 37.89,47.22 39.51,45.6 U7.32
  Top 0.406: C10.1 38.28,50.29
N$11
  Top 0.254: U$4.2 28.93,48.85 29.16,49.08 L1.1
N$12
  Top 0.254: U$4.6 30.56,46.78 L1.2 30.86,46.48 L2.1 C15.2
N$14  (via drill 0.8 pad 1.42)
  other vias: 19.5,39
N$15  (via drill 2.8)
  Top 1.27: U$13.P$1 v52.35,2.5 v52.35,2.51
N$16  (via drill 2.8)
  Top 1.27: U$12.P$1 61.65,2.5 v61.65,2.52
N$17  (via drill 0.8 pad 1.42)
  other vias: 19.5,37
N$18  (via drill 0.8 pad 1.42)
  Top 0.254: R18.1 17,34.06 v17,37
N$19
  Top 0.3: F1.1 44.37,45.02 U$1.P$1
N$20  (via drill 0.8 pad 1.42)
  Top 0.254: R17.1 15.1,37.1 v17,39
N$24
  Top 0.254: U7.20 40.01,34.03 R2.1
N$26
  Top 0.2: U$23.5 6.16,38.66 4.5,37 LED1.C
N$27
  Top 0.2: LED1.A 1.75,35.6 R9.2
N$28
  Bottom 0.254: LED4.A 26,7.66 R14.1
N$29
  Bottom 0.254: R15.1 26.01,1.87 LED5.A
N$41
  Top 0.254: U$23.4 4.9,39.2 arc90 R11.1
N$49
  Top 0.254: U$23.2 4.75,40.01 arc-90 R12.1
N$51  (via drill 0.8 pad 1.42)
  Top 0.2: U$23.8 9.4,39.6 10,39 15,39 v17,41
N$52  (via drill 0.8 pad 1.42)
  Top 0.254: R10.2 17.62,42.88 v19.5,41
P2_1  (via drill 0.3)
  Top 0.2: X1.D+ 21.06,48.95 v21.1,48.99 | v37.02,45.72 37.32,45.72 38.01,45.03 U7.35
  Bottom 0.2: v21.1,48.99 21.85,49.74 33,49.74 v37.02,45.72
P2_2  (via drill 0.3)
  Top 0.2: X1.ID 20.41,48.68 v20.1,48.99 | v36.63,47.01 38.51,45.13 U7.34
  Bottom 0.2: v20.1,48.99 21.25,50.14 33.5,50.14 v36.63,47.01
RST  (via drill 0.3)
  Top 0.2: X1.D- 21.71,48.6 v22.1,48.99
  Top 0.254: v40.03,31.81 v40.04,31.8 R2.2 42.22,31.8 C13.2
  Bottom 0.2: v22.11,48.98 v22.1,48.99 22.97,48.99 27.46,44.5
  Bottom 0.254: v40.03,31.81 39.11,31.81 32.37,38.55 32.37,42.57 30.44,44.5 27.46,44.5
RX  (via drill 0.3, 0.6)
  Top 0.254: U1.2 v35,22 | U7.5 30.84,41.7 v29.36,40.22
  Bottom 0.254: v35,22 35,31.6 29.82,36.78 29.82,39.76 v29.36,40.22
SCL  (via drill 0.8)
  Top 0.254: R4.1 24.74,39.24 v25.5,40
  Top 0.305: U7.2 26.2,43.2 25.5,42.5 v25.5,40
  Bottom 0.254: 25,9.01 25,6.65 24.93,6.58 | 24.93,6.58 24.74,6.39 U5.SCL | U6.SCL 24.38,1.89 25,2.51 25,6.51 24.93,6.58
  Bottom 0.305: 25,9.01 27.5,11.51 27.5,38 v25.5,40
SCL_B  (via drill 0.8)
  Top 0.254: U$8.3 39,57 v41,59
SCL_S
  Top 0.254: U$9.6 58.63,51.37 57,53 X2.D+
SDA  (via drill 0.3, 0.8)
  Top 0.254: U7.3 29.54,42.7 | v27,9.01 23.5,5.51 | 23.5,5.51 23.5,1.51 v23,1.01 | 23.5,5.51 v23,5.51 | v27.5,40 28.31,39.19 R3.2 28.58,36.84 v28.58,35.66
  Top 0.305: v27.5,40 27.5,40.66 29.54,42.7
  Bottom 0.254: v28.58,35.66 28.5,35.65 28.5,10.51 v27,9.01 | U5.SDA 23.02,5.53 v23,5.51 | U6.SDA 23.02,1.02 v23,1.01
SDA_B  (via drill 0.8)
  Top 0.254: U$8.2 39.65,56.65 41,58 42,58 v43,59
SDA_S
  Top 0.254: X2.D- 57.65,57.15 58,57.5 59.5,57.5 61.5,55.5 61.5,50.85 60.75,50.1 U$9.5
SWITCH1
  Top 0.254: U7.19 39.51,34.01 30.5,25 15.18,25 S2.3
TS
  Top 0.254: U$23.9 R13.1
TX  (via drill 0.3, 0.6)
  Top 0.254: U1.1 v36.5,21.99 | U7.6 31.39,41.2 v30.4,40.21
  Bottom 0.254: v30.4,40.21 30.4,37.08 36.52,30.96 36.52,22.01 v36.5,21.99
VBUS  (via drill 0.3)
  Top 0.254: C27.2 6.17,40.41 U$23.1
  Top 0.3: C27.2 v6.17,42.91 | X1.VBUS 22.36,46.05 arc-90 21.45,45.14 v11.99,45.14
  Bottom 0.3: 6.16,42.86 arc90 v6.17,42.91 6.17,44.02 arc-90 7.29,45.14 v11.99,45.14
VIN
  Top 0.254: U$4.3 27.23,48.14 C14.2 | 20.25,34.97 C20.2 20.2,35.28 20.25,35.23 U4.1 | 22.55,28.63 C23.2 | S1.S2 10.13,46.87 | 21.52,36.62 21.52,36.5
  Top 0.3: 16.5,44 arc-90 21.52,38.98 21.52,36.5 21.52,36.31 | S1.S2 10.13,45.46 arc90 11.59,44 16.5,44 | 21.52,36.31 21.52,29.39 arc90 C23.2 | 21.52,36.31 arc-90 C20.2 | C14.2 26.24,47.97 arc90 24.19,45.92 24.19,45.7 | 24.19,45.7 arc-90 22.49,44 16.5,44 | R7.2 24.21,44.29 arc90 24,44.5 24.19,44.5 24.19,45.7
  Top 0.305: 22.55,28.63 U2.1 22.55,30.5

### Text on the board
tPlace: CHG | + | PLUG | - | PWD | -